# Altium schematic sheet Table Of Contents.SchDoc: =ProjectName
size A4; CompanyName: Catcatcat Electronics; Engineer: Hena Chernov; SheetNumber: 4; SheetTotal: 10; CodePhone: +380505759863; SheetDescription: List of project sheets.; Email: catcatcat.electronics@gmail.com
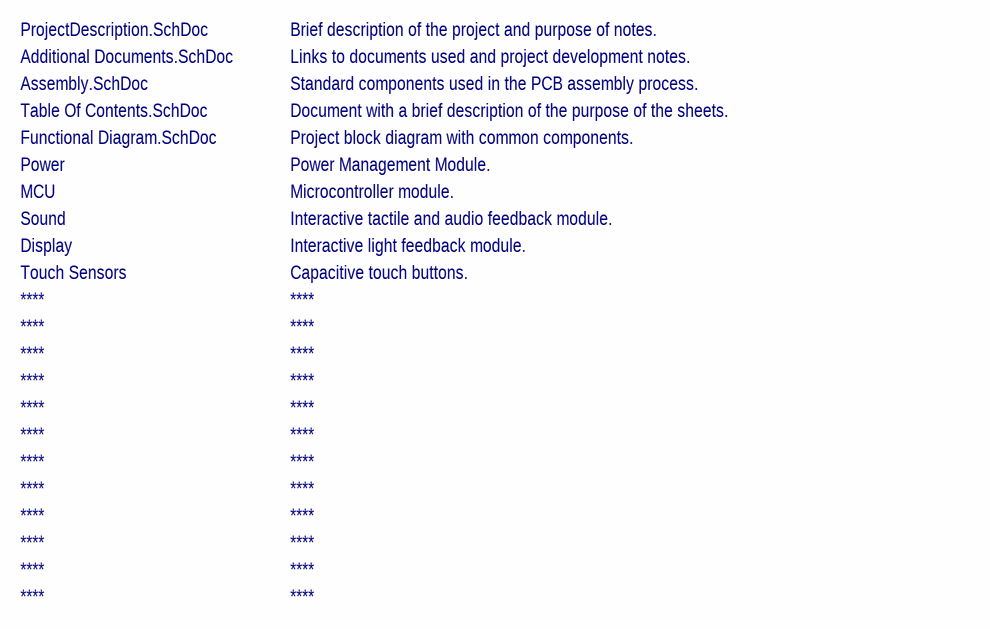
[diagram p0: Table Of Contents.SchDoc]

## Notes on the sheet
- Additional Documents.SchDoc
- ProjectDescription.SchDoc
- Links to documents used and project development notes.
- Brief description of the project and purpose of notes.
- Table Of Contents.SchDoc
- Assembly.SchDoc
- Document with a brief description of the purpose of the sheets.
- Standard components used in the PCB assembly process.
- Power
- MCU
- Functional Diagram.SchDoc
- Power Management Module.
- Microcontroller module.
- Project block diagram with common components.
- Sound
- Display
- Interactive tactile and audio feedback module.
- Interactive light feedback module.
- Touch Sensors
- ****
- Capacitive touch buttons.
- TABLE OF CONTENTS
- Sheet NO:
- Sheet name
- Notes
- 1
- 2
- 3
- 4
- 5
- 7
- 6
- 8
- 9
- 10
- 11
- 12
- 13
- 14
- 15
- 16
- 17
- 18
- 19
- 20
- 21
- 22
- Project Title:
- Project Version:
- Designed for:
- Lead Project
- Project ID:
- Development company
- Date:
- PCB Revision:
- PCB Name:
- Sheet Title:
- Assembly Variant:
- Time:
- Sheet
- of
- Engineer SCH:
- Engineer PCB:
- Inspection PRJ:
- Size: A4
- File: